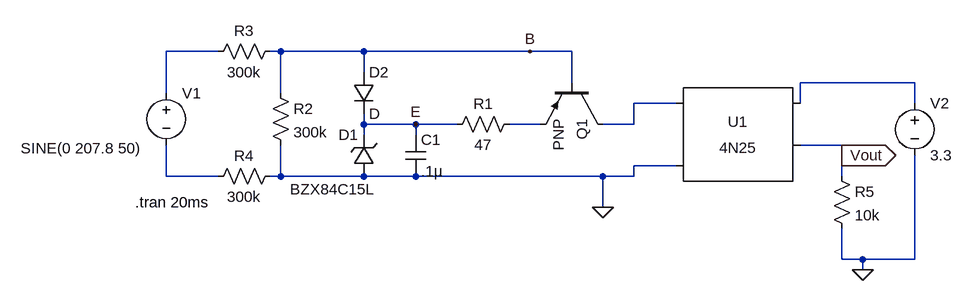
[diagram p0: schematic ZC_detection.asc]
ZC_detection.asc, the LTspice schematic file:
Version 4
SHEET 1 1020 680
WIRE -112 112 -192 112
WIRE -16 112 -32 112
WIRE 112 112 -16 112
WIRE 368 112 112 112
WIRE 432 112 368 112
WIRE 112 144 112 112
WIRE 432 160 432 112
WIRE 960 160 784 160
WIRE -192 176 -192 112
WIRE -16 176 -16 112
WIRE 592 192 528 192
WIRE 784 192 784 160
WIRE 960 192 960 160
WIRE 112 224 112 208
WIRE 192 224 112 224
WIRE 256 224 192 224
WIRE 384 224 336 224
WIRE 528 224 528 192
WIRE 528 224 480 224
WIRE 112 240 112 224
WIRE 192 240 192 224
WIRE 848 256 784 256
WIRE 848 272 848 256
WIRE 592 288 528 288
WIRE -192 304 -192 256
WIRE -112 304 -192 304
WIRE -16 304 -16 256
WIRE -16 304 -32 304
WIRE 112 304 -16 304
WIRE 192 304 112 304
WIRE 480 304 192 304
WIRE 528 304 528 288
WIRE 528 304 480 304
WIRE 848 304 848 272
WIRE 480 352 480 304
WIRE 848 432 848 384
WIRE 880 432 848 432
WIRE 960 432 960 272
WIRE 960 432 880 432
WIRE 880 448 880 432
FLAG 880 448 0
FLAG 480 352 0
FLAG 368 112 B
FLAG 192 224 E
FLAG 848 272 Vout
IOPIN 848 272 Out
SYMBOL zener 128 304 R180
WINDOW 0 24 64 Left 2
WINDOW 3 -2 -20 Left 2
SYMATTR InstName D1
SYMATTR Value BZX84C15L
SYMATTR Description Diode
SYMATTR Type diode
SYMBOL cap 176 240 R0
SYMATTR InstName C1
SYMATTR Value .1µ
SYMBOL res 352 208 R90
WINDOW 0 0 56 VBottom 2
WINDOW 3 32 56 VTop 2
SYMATTR InstName R1
SYMATTR Value 47
SYMBOL pnp 480 160 R90
SYMATTR InstName Q1
SYMBOL voltage -192 160 R0
WINDOW 3 -224 101 Left 2
WINDOW 123 0 0 Left 2
WINDOW 39 0 0 Left 2
SYMATTR Value SINE(0 207.8 50)
SYMATTR InstName V1
SYMBOL res -32 160 R0
SYMATTR InstName R2
SYMATTR Value 300k
SYMBOL res -16 96 R90
WINDOW 0 0 56 VBottom 2
WINDOW 3 32 56 VTop 2
SYMATTR InstName R3
SYMATTR Value 300k
SYMBOL res -16 288 R90
WINDOW 0 0 56 VBottom 2
WINDOW 3 32 56 VTop 2
SYMATTR InstName R4
SYMATTR Value 300k
SYMBOL diode 96 144 R0
SYMATTR InstName D2
SYMBOL res 832 288 R0
SYMATTR InstName R5
SYMATTR Value 10k
SYMBOL Optos\\4N25 688 256 R0
SYMATTR InstName U1
SYMBOL voltage 960 176 R0
WINDOW 123 0 0 Left 2
WINDOW 39 0 0 Left 2
SYMATTR InstName V2
SYMATTR Value 3.3
TEXT -240 344 Left 2 !.tran 20ms

The netlist it stands for:
* ZC_detection.asc
D1 0 E BZX84C15L
C1 E 0 .1µ
R1 N004 E 47
Q1 N003 B N004 0 PNP
V1 N001 N005 SINE(0 207.8 50)
R2 B 0 300k
R3 B N001 300k
R4 0 N005 300k
D2 B E D
R5 Vout 0 10k
XU1 N003 0 N002 Vout NC_01 4N25
V2 N002 0 3.3
.model D D
.lib standard.dio
.model NPN NPN
.model PNP PNP
.lib standard.bjt
.tran 20ms
.lib 4N25.sub
.backanno
.end